# EAGLE design ESP8266_Unu_TFT (EAGLE 9.5.1)
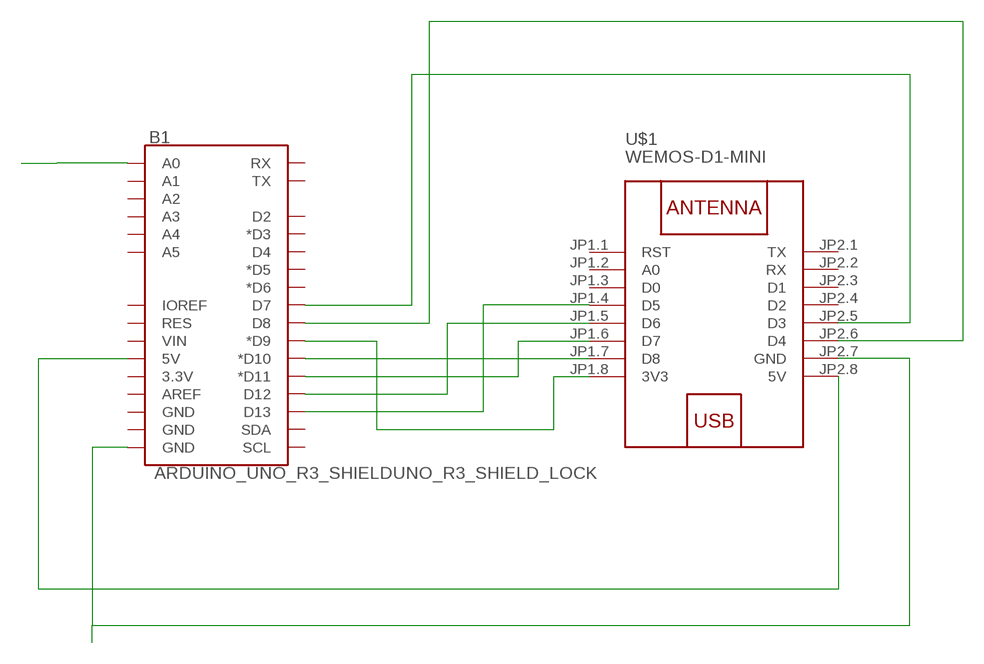
[diagram p0: schematic, sheet 1]

## Parts
B1  ARDUINO_UNO_R3_SHIELDUNO_R3_SHIELD_LOCK  [UNO_R3_SHIELD_LOCK]
U$1  WEMOS-D1-MINI  [WEMOS-D1-MINI]

## Nets
N$1: B1.D13 U$1.JP1.4(D5)
N$2: B1.D12 U$1.JP1.5(D6)
N$3: B1.D11(*D11) U$1.JP1.6(D7)
N$4: B1.D10(*D10) U$1.JP1.7(D8)
N$5: B1.D9(*D9) U$1.JP1.8(3V3)
N$6: B1.5V U$1.JP2.8(5V)
N$7: B1.D7 U$1.JP2.5(D3)
N$8: B1.D8 U$1.JP2.6(D4)
N$9: B1.GND@0(GND) U$1.JP2.7(GND)
N$10: B1.A0
Unconnected: B1.3.3V B1.A1 B1.A2 B1.A3 B1.A4 B1.A5 B1.AREF B1.D2 B1.D3(*D3) B1.D4 B1.D5(*D5) B1.D6(*D6) B1.GND@1(GND) B1.GND@2(GND) B1.IOREF B1.RES B1.RX B1.SCL B1.SDA B1.TX B1.VIN U$1.JP1.1(RST) U$1.JP1.2(A0) U$1.JP1.3(D0) U$1.JP2.1(TX) U$1.JP2.2(RX) U$1.JP2.3(D1) U$1.JP2.4(D2)

## Library data of the parts
B1 = SparkFun-Boards:ARDUINO_UNO_R3_SHIELD: Arduino R3 Shield Footprint Shield form compatible with the Arduino Uno R3. SparkFun Products: MG2639 Cellular Shield <https://www.sparkfun.com/products/13120> MIDI Shield <https://www.sparkfun.com/products/12898> R3 Stackable Headers Kit <https://www.sparkfun.com/products/11417>
U$1 = diy-modules:WEMOS-D1-MINI: WEMOS D1 mini: Mini Wi-Fi Board based on ESP-8266 device More details can be found here: https://www.wemos.cc/product/d1-mini.html Click here to find device on ebay.com <http://www.ebay.com/sch/wemos+d1+mini+nodemcu>

## Board
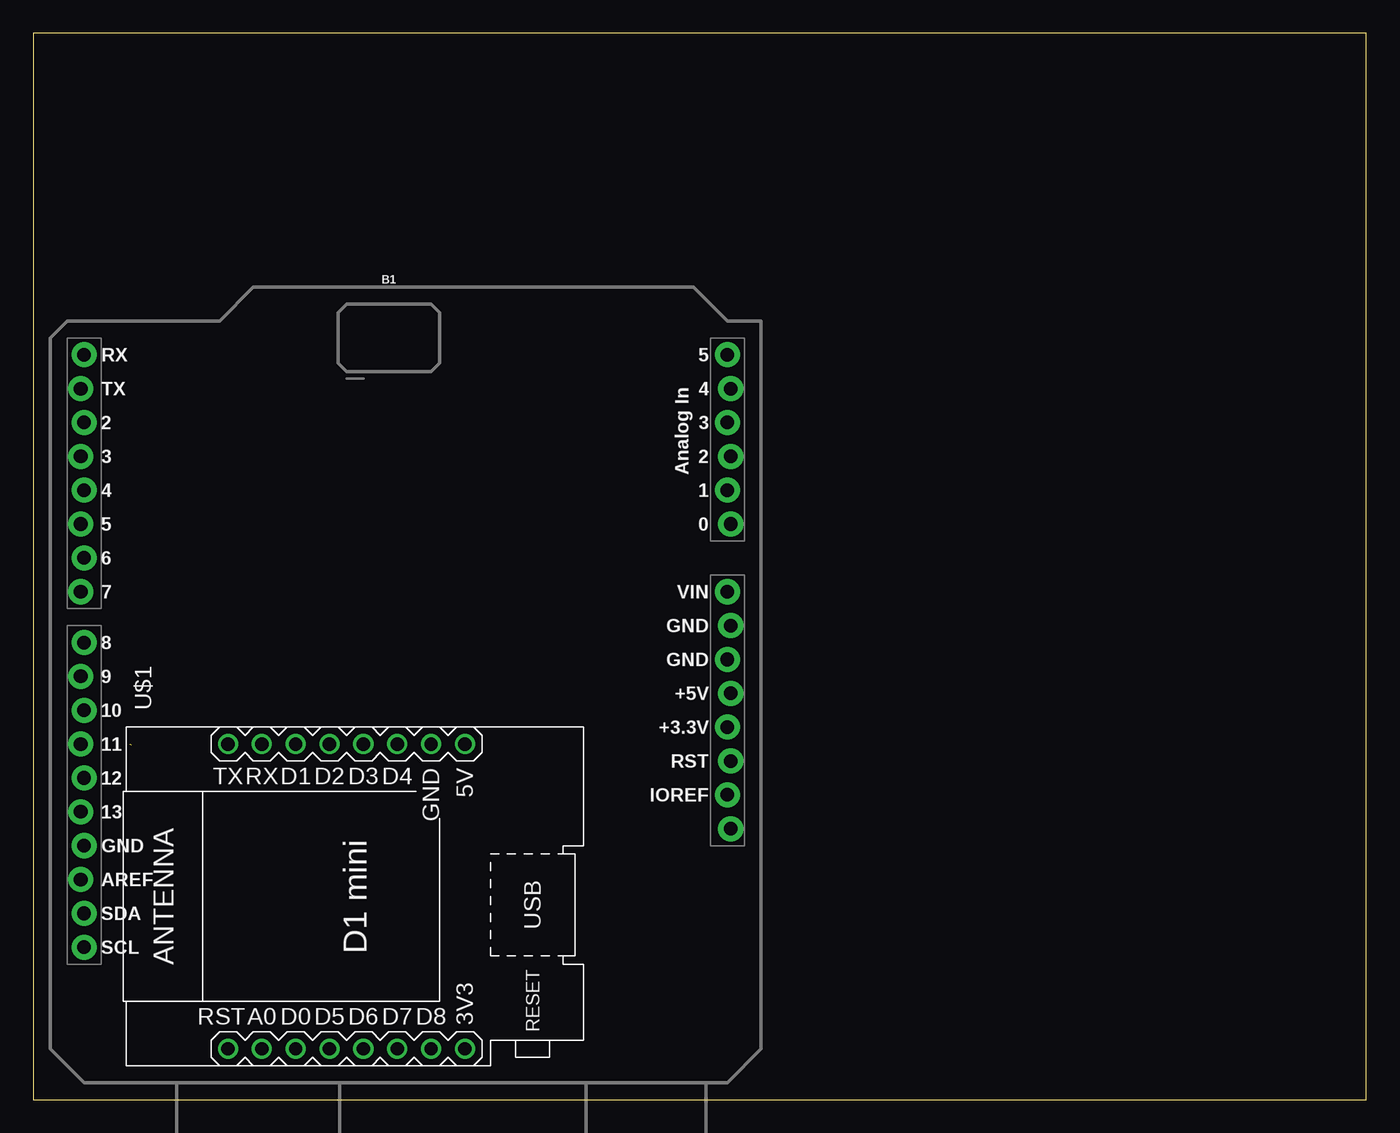
[diagram p1: board, top side]
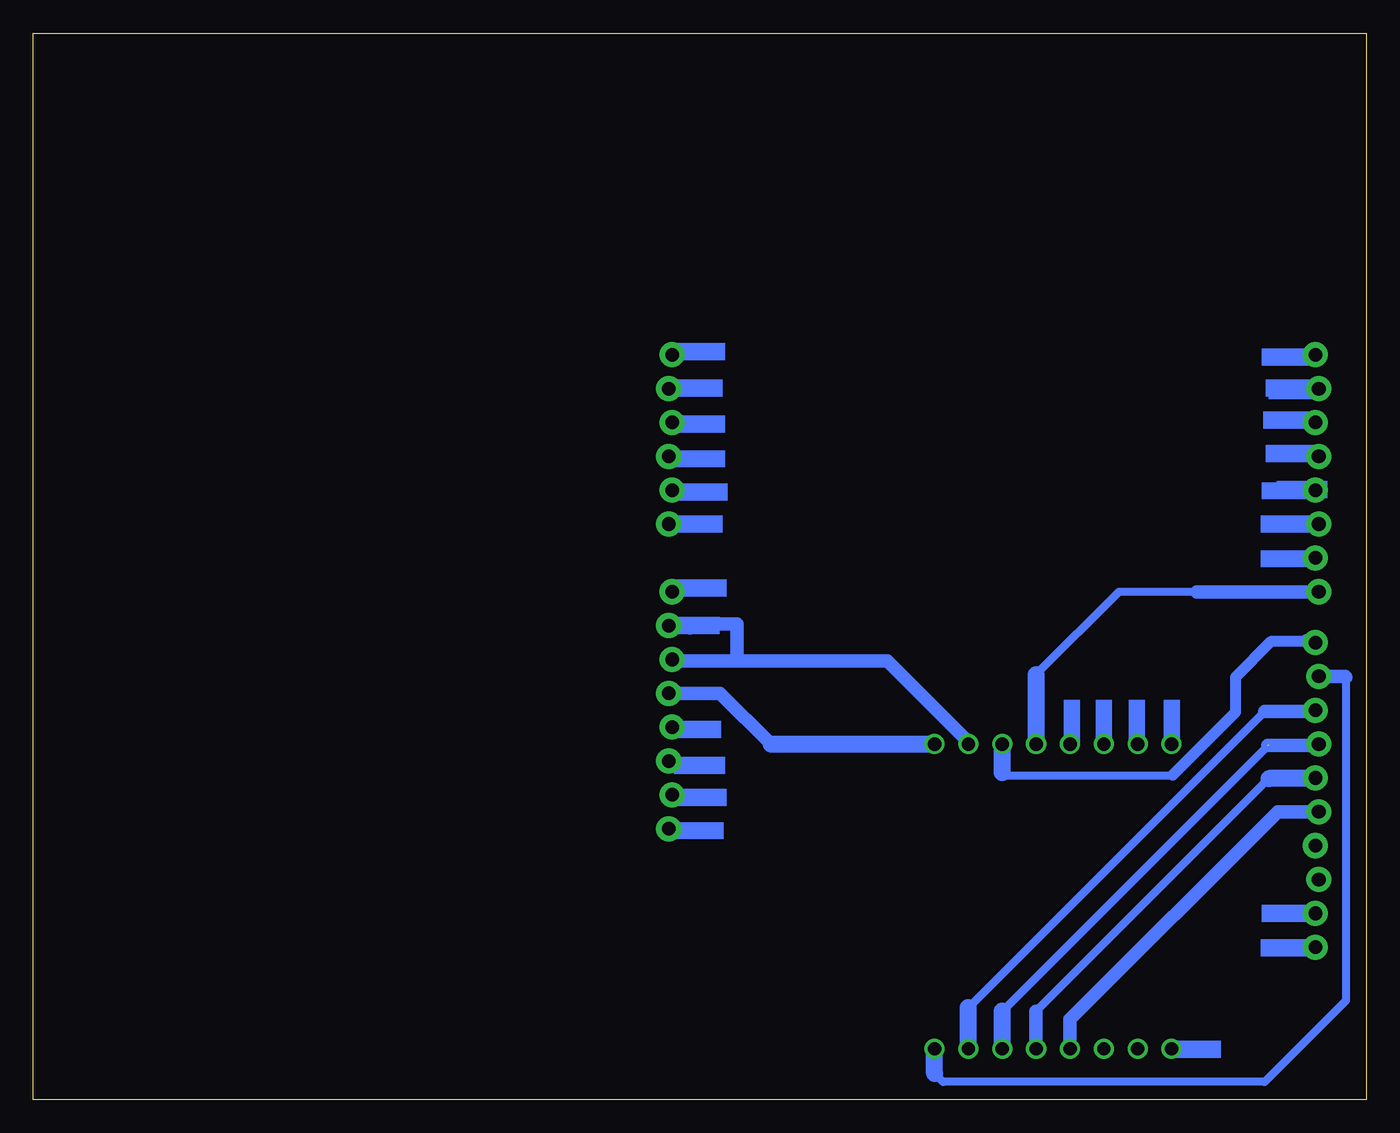
[diagram p2: board, bottom side, seen from below]

Size 100 x 80 mm. Coordinates in mm from the lower left corner, seen from the top.
Outline: 0,0 100,0 100,80 0,80 0,0
Copper layers (1*16): Top 0.035mm / dielectric 1.5mm / Bottom 0.035mm
Design rules "default": minimum track width 6mil, minimum drill 0.35mm, track to track 6mil, track to pad 6mil, pad to pad 6mil, via to via 6mil, smd to smd 6mil, copper to edge 40mil, drill to drill 6mil, minimum pad ring 10mil, minimum via ring 8mil, stop-mask expansion 4mil, vias tented up to drill 0mil, thermal gap 10mil

### Footprints (pad centres in the part's own frame; a part is rotated, then mirrored left to right if it is on the bottom)
UNO_R3_SHIELD_LOCK = drill 1.016 pad 1.88: 3.3V 24.13,-3.81; 5V 24.384,-1.27; A0 24.384,11.43; A1 24.13,13.97; A2 24.384,16.51; A3 24.13,19.05; A4 24.384,21.59; A5 24.13,24.13; AREF -24.384,-15.24; D2 -24.13,19.05; D3 -24.384,16.51; D4 -24.13,13.97; D5 -24.384,11.43; D6 -24.13,8.89; D7 -24.384,6.35; D8 -24.13,2.54; D9 -24.384,0; D10 -24.13,-2.54; D11 -24.384,-5.08; D12 -24.13,-7.62; D13 -24.384,-10.16; GND@0 24.13,1.27; GND@1 24.384,3.81; GND@2 -24.13,-12.7; IOREF 24.13,-8.89; NC 24.384,-11.43; RES 24.384,-6.35; RX -24.13,24.13; SCL -24.13,-20.32; SDA -24.13,-17.78; TX -24.384,21.59; VIN 24.13,6.35
WEMOS-D1-MINI = drill 1: JP1.1 -11.43,9.525; JP1.2 -11.43,6.985; JP1.3 -11.43,4.445; JP1.4 -11.43,1.905; JP1.5 -11.43,-0.635; JP1.6 -11.43,-3.175; JP1.7 -11.43,-5.715; JP1.8 -11.43,-8.255; JP2.1 11.43,9.525; JP2.2 11.43,6.985; JP2.3 11.43,4.445; JP2.4 11.43,1.905; JP2.5 11.43,-0.635; JP2.6 11.43,-3.175; JP2.7 11.43,-5.715; JP2.8 11.43,-8.255

### Placement (x,y rotation side)
B1  27.94,31.75 0 top
U$1  24.13,15.24 90 top

### Tracks (layer width: path | path; a pad name or v marks a point on that pad's centre or on a via)
N$1
  Bottom 1.016: U$1.JP1.4 22.23,6.01 6.64,21.59 B1.D13
N$2
  Bottom 0.152: 3.81,24.08 B1.D12
  Bottom 0.61: 24.77,6.61 7.29,24.08
  Bottom 1.016: 24.77,6.61 U$1.JP1.5
  Bottom 1.27: 3.81,24.08 7.29,24.08
N$3  (1 unrouted)
  Bottom 0.61: 27.3,6.63 7.27,26.66
  Bottom 1.016: 7.4,26.57 3.66,26.57 B1.D11
  Bottom 1.27: U$1.JP1.6 27.3,6.63
N$4
  Bottom 0.61: 29.84,6.88 7.62,29.11 | B1.D10 3.91,29.11
  Bottom 1.016: 7.62,29.11 3.91,29.11
  Bottom 1.27: U$1.JP1.7 29.84,6.88
N$5
  Bottom 0.61: U$1.JP1.8 32.31,3.89 | 1.52,31.68 1.52,7.42 7.62,1.32 31.75,1.32 32.38,1.96
  Bottom 1.016: B1.D9 1.59,31.75 1.52,31.68
  Bottom 1.27: 32.38,1.96 U$1.JP1.8
N$6
  Bottom 1.016: 44.65,26.67 48.46,30.48 B1.5V
  Bottom 1.27: 44.65,26.67 U$1.JP2.8
N$7
  Bottom 0.61: 12.7,38.1 18.54,38.1 24.77,31.88 | 12.7,38.1
  Bottom 1.016: B1.D7 12.7,38.1
  Bottom 1.27: 24.77,31.88 U$1.JP2.5
N$8
  Bottom 0.152: 27.3,24.54 27.1,24.33
  Bottom 0.61: 27.1,24.33 14.54,24.33
  Bottom 0.813: 14.54,24.33 9.8,29.07 9.8,31.7 7.11,34.39 4.48,34.39
  Bottom 1.016: B1.D8 3.91,34.39 4.48,34.39
  Bottom 1.27: 27.3,24.54 U$1.JP2.6
N$9
  Bottom 0.152: 51.97,32.92 B1.GND@0
  Bottom 0.61: U$1.JP2.7 29.84,26.85
  Bottom 1.016: 29.84,26.85 35.92,32.92 47.2,32.92 | 51.97,32.92 47.2,32.92 | 47.2,32.92 47.2,35.7 50.72,35.7 50.72,35.4
(copper drawn outside any net)
  shapes: Bottom area x28